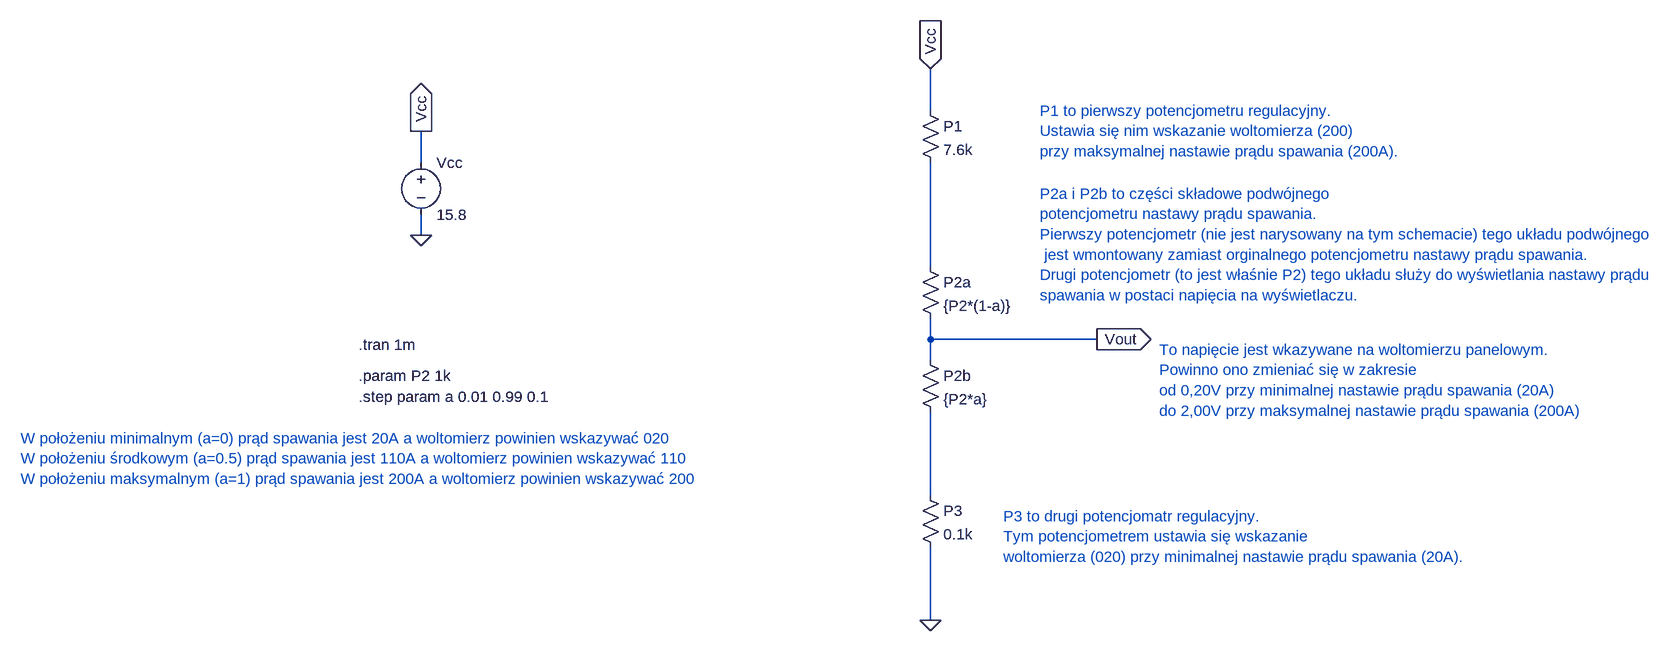
[diagram p0: schematic current_setting_display.asc]
current_setting_display.asc, the LTspice schematic file:
Version 4
SHEET 1 2236 804
WIRE 768 -16 768 -80
WIRE -16 64 -16 16
WIRE -16 176 -16 144
WIRE 768 224 768 64
WIRE 768 336 768 304
WIRE 1024 336 768 336
WIRE 768 368 768 336
WIRE 768 576 768 448
WIRE 768 768 768 656
FLAG -16 176 0
FLAG -16 16 Vcc
IOPIN -16 16 Out
FLAG 768 -80 Vcc
IOPIN 768 -80 In
FLAG 768 768 0
FLAG 1024 336 Vout
IOPIN 1024 336 Out
SYMBOL voltage -16 48 R0
WINDOW 123 0 0 Left 0
WINDOW 39 0 0 Left 0
SYMATTR InstName Vcc
SYMATTR Value 15.8
SYMBOL res 752 -32 R0
SYMATTR InstName P1
SYMATTR Value 7.6k
SYMBOL res 752 208 R0
SYMATTR InstName P2a
SYMATTR Value {P2*(1-a)}
SYMBOL res 752 352 R0
SYMATTR InstName P2b
SYMATTR Value {P2*a}
SYMBOL res 752 560 R0
SYMATTR InstName P3
SYMATTR Value 0.1k
TEXT -112 424 Left 2 !.step param a 0.01 0.99 0.1
TEXT -112 392 Left 2 !.param P2 1k
TEXT -112 344 Left 2 !.tran 1m
TEXT 936 -16 Left 2 ;P1 to pierwszy potencjometru regulacyjny.\nUstawia się nim wskazanie woltomierza (200)\nprzy maksymalnej nastawie prądu spawania (200A).
TEXT 936 112 Left 2 ;P2a i P2b to części składowe podwójnego \npotencjometru nastawy prądu spawania.\nPierwszy potencjometr (nie jest narysowany na tym schemacie) tego układu podwójnego\n jest wmontowany zamiast orginalnego potencjometru nastawy prądu spawania.\nDrugi potencjometr (to jest właśnie P2) tego układu służy do wyświetlania nastawy prądu\nspawania w postaci napięcia na wyświetlaczu.
TEXT 880 608 Left 2 ;P3 to drugi potencjomatr regulacyjny.\nTym potencjometrem ustawia się wskazanie \nwoltomierza (020) przy minimalnej nastawie prądu spawania (20A).
TEXT 1120 352 Left 2 ;To napięcie jest wkazywane na woltomierzu panelowym.\nPowinno ono zmieniać się w zakresie \nod 0,20V przy minimalnej nastawie prądu spawania (20A)\ndo 2,00V przy maksymalnej nastawie prądu spawania (200A)
TEXT -632 488 Left 2 ;W położeniu minimalnym (a=0) prąd spawania jest 20A a woltomierz powinien wskazywać 020\nW położeniu środkowym (a=0.5) prąd spawania jest 110A a woltomierz powinien wskazywać 110\nW położeniu maksymalnym (a=1) prąd spawania jest 200A a woltomierz powinien wskazywać 200

The netlist it stands for:
* current_setting_display.asc
Vcc Vcc 0 15.8
R§P1 Vcc N001 7.6k
R§P2a N001 Vout {P2*(1-a)}
R§P2b Vout N002 {P2*a}
R§P3 N002 0 0.1k
.step param a 0.01 0.99 0.1
.param P2 1k
.tran 1m
* P1 to pierwszy potencjometru regulacyjny.
* Ustawia się nim wskazanie woltomierza (200)
* przy maksymalnej nastawie prądu spawania (200A).
* P2a i P2b to części składowe podwójnego
* potencjometru nastawy prądu spawania.
* Pierwszy potencjometr (nie jest narysowany na tym schemacie) tego układu podwójnego
*  jest wmontowany zamiast orginalnego potencjometru nastawy prądu spawania.
* Drugi potencjometr (to jest właśnie P2) tego układu służy do wyświetlania nastawy prądu
* spawania w postaci napięcia na wyświetlaczu.
* P3 to drugi potencjomatr regulacyjny.
* Tym potencjometrem ustawia się wskazanie
* woltomierza (020) przy minimalnej nastawie prądu spawania (20A).
* To napięcie jest wkazywane na woltomierzu panelowym.
* Powinno ono zmieniać się w zakresie
* od 0,20V przy minimalnej nastawie prądu spawania (20A)
* do 2,00V przy maksymalnej nastawie prądu spawania (200A)
* W położeniu minimalnym (a=0) prąd spawania jest 20A a woltomierz powinien wskazywać 020
* W położeniu środkowym (a=0.5) prąd spawania jest 110A a woltomierz powinien wskazywać 110
* W położeniu maksymalnym (a=1) prąd spawania jest 200A a woltomierz powinien wskazywać 200
.backanno
.end